# Altium schematic sheet 03-M2Finger.SchDoc
size A; SheetNumber: 3; SheetTotal: 16
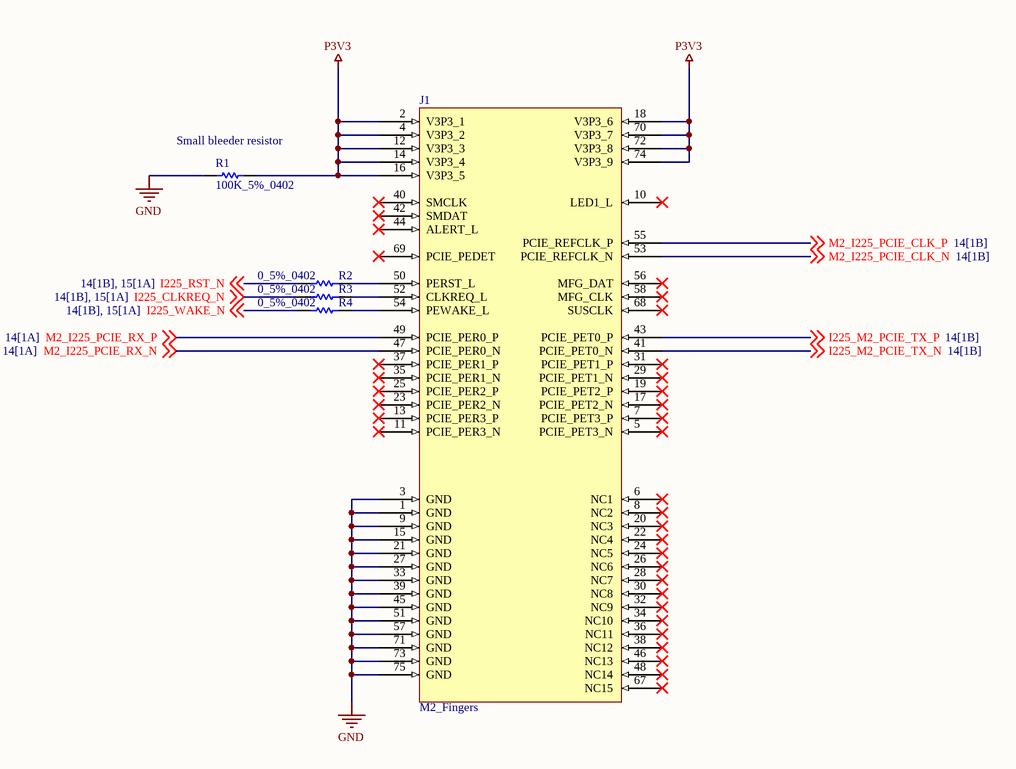
[diagram p0: 03-M2Finger.SchDoc]

## Parts
J1  M2_Fingers  [M.2 PCIe fingers]
R1  100K_5%_0402  [RESC1005X40X25LL05T05]
R2  0_5%_0402  [RESC1005X40X25LL10T10]
R3  0_5%_0402  [RESC1005X40X25LL10T10]
R4  0_5%_0402  [RESC1005X40X25LL10T10]

## Nets
GND: J1.1(GND) J1.3(GND) J1.9(GND) J1.15(GND) J1.21(GND) J1.27(GND) J1.33(GND) J1.39(GND) J1.45(GND) J1.51(GND) J1.57(GND) J1.71(GND) J1.73(GND) J1.75(GND) R1.1
P3V3: J1.2(V3P3_1) J1.4(V3P3_2) J1.12(V3P3_3) J1.14(V3P3_4) J1.16(V3P3_5) J1.18(V3P3_6) J1.70(V3P3_7) J1.72(V3P3_8) J1.74(V3P3_9) R1.2
I225_CLKREQ_N: R3.1 ; off-sheet I225_CLKREQ_N
I225_M2_PCIE_TX_N: J1.41(PCIE_PET0_N) ; off-sheet I225_M2_PCIE_TX_N
I225_M2_PCIE_TX_P: J1.43(PCIE_PET0_P) ; off-sheet I225_M2_PCIE_TX_P
I225_RST_N: R2.1 ; off-sheet I225_RST_N
I225_WAKE_N: R4.1 ; off-sheet I225_WAKE_N
M2_I225_PCIE_CLK_N: J1.53(PCIE_REFCLK_N) ; off-sheet M2_I225_PCIE_CLK_N
M2_I225_PCIE_CLK_P: J1.55(PCIE_REFCLK_P) ; off-sheet M2_I225_PCIE_CLK_P
M2_I225_PCIE_RX_N: J1.47(PCIE_PER0_N) ; off-sheet M2_I225_PCIE_RX_N
M2_I225_PCIE_RX_P: J1.49(PCIE_PER0_P) ; off-sheet M2_I225_PCIE_RX_P
NetJ1_50: J1.50(PERST_L) R2.2
NetJ1_52: J1.52(CLKREQ_L) R3.2
NetJ1_54: J1.54(PEWAKE_L) R4.2

Not connected (* = marked no-connect by the designer): J1 5(PCIE_PET3_N)* 6(NC1)* 7(PCIE_PET3_P)* 8(NC2)* 10(LED1_L)* 11(PCIE_PER3_N)* 13(PCIE_PER3_P)* 17(PCIE_PET2_N)* 19(PCIE_PET2_P)* 20(NC3)* 22(NC4)* 23(PCIE_PER2_N)* 24(NC5)* 25(PCIE_PER2_P)* 26(NC6)* 28(NC7)* 29(PCIE_PET1_N)* 30(NC8)* 31(PCIE_PET1_P)* 32(NC9)* 34(NC10)* 35(PCIE_PER1_N)* 36(NC11)* 37(PCIE_PER1_P)* 38(NC12)* 40(SMCLK)* 42(SMDAT)* 44(ALERT_L)* 46(NC13)* 48(NC14)* 56(MFG_DAT)* 58(MFG_CLK)* 67(NC15)* 68(SUSCLK)* 69(PCIE_PEDET)*

## Notes on the sheet
- (near R1) Small bleeder resistor

## Library data of the parts
R1 = CMP-2002-08125-1: Part Number: CRCW0402100KJNED; Manufacturer: Vishay Dale
R2-R4 = CMP-2002-04569-1: Manufacturer: KOA Speer; Part Number: RK73Z1ETTP